# Altium schematic sheet Data Logger.SchDoc
size A; DocumentNumber: 10; SheetNumber: 10; SheetTotal: 16
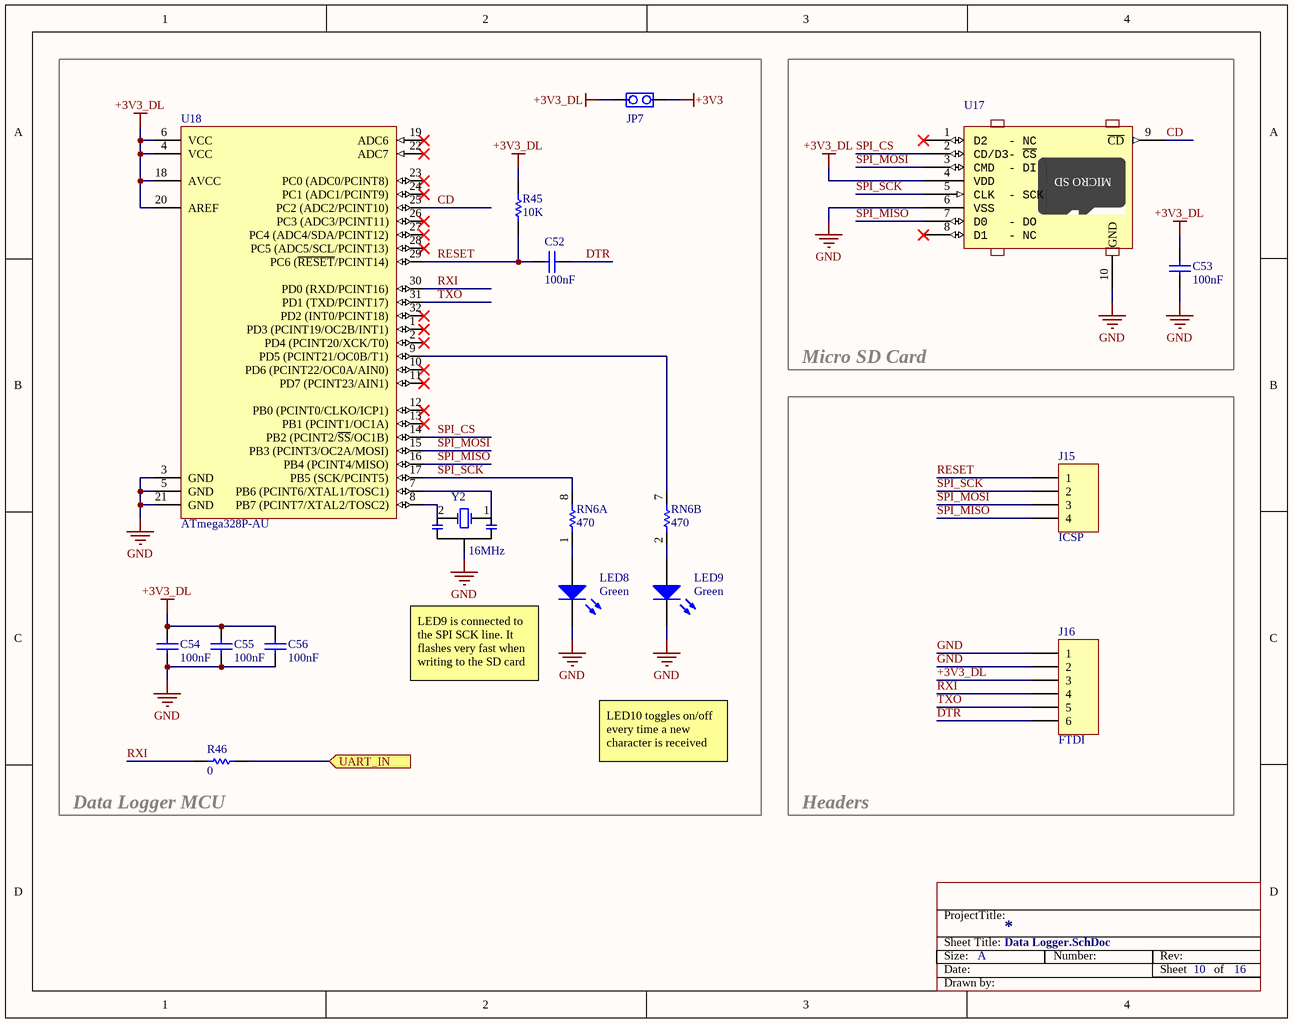
[diagram p0: Data Logger.SchDoc]

## Parts
C52  value 100nF  [CAP_0402[1005M]]  (hidden comment: Cap)
C53  value 100nF  [CAP_0402[1005M]]  (hidden comment: Cap)
C54  value 100nF  [CAP_0402[1005M]]  (hidden comment: Cap)
C55  value 100nF  [CAP_0402[1005M]]  (hidden comment: Cap)
C56  value 100nF  [CAP_0402[1005M]]  (hidden comment: Cap)
J15  ICSP  [1X04]  (no BOM)
J16  FTDI  [HEADER RA 6 2.54]
JP7  Jumper  [HDR_1x02_JMP]  (value not drawn)  (no BOM)
LED8  Color: Green  [LED_0603[1608M]]  (hidden comment: LED)
LED9  Color: Green  [LED_0603[1608M]]  (hidden comment: LED)
R45  value 10K  [RES_0402[1005M]]  (hidden comment: RES)
R46  value 0  [JUMPER_RES_0402]  (hidden comment: RES)
RN6  value 470  [RES ARRAY SMD]  (hidden comment: Res Network 1)  (parts A,B of 4)
U17  MICRO-SD_1  [MICRO-SD_1]  (value not drawn)
U18  ATmega328P-AU  [TQFP32A_M]
Y2  Frequency: 16MHz  [RESONATOR_3213]  (hidden comment: XTAL_3)

## Blocks framed on the sheet
Data Logger MCU: C52 C54-C56 JP7 LED8 LED9 R45 R46 RN6 U18 Y2
Micro SD Card: C53 U17
Headers: J15 J16

## Ports
UART_IN (in)

## Nets
+3V3: JP7.2
+3V3_DL: C53.1 C54.1 C55.1 C56.1 J16.3 JP7.1 R45.2 U17.4(VDD) U18.4(VCC) U18.6(VCC) U18.18(AVCC) U18.20(AREF)
GND: C53.2 C54.2 C55.2 C56.2 J16.1 J16.2 LED8.2(K) LED9.2(K) U17.6(VSS) U17.10(GND) U18.3(GND) U18.5(GND) U18.21(GND) Y2.3(GND)
CD: U17.9(~{CD}) U18.25(PC2_(ADC2/PCINT10))
DTR: C52.2 J16.6
RESET: C52.1 J15.1 R45.1 U18.29(PC6_(~{RESET}/PCINT14))
RXI: J16.4 R46.2 U18.30(PD0_(RXD/PCINT16))
SPI_CS: U17.2(CD/D3-_~{CS}) U18.14(PB2_(PCINT2/~{SS}/OC1B))
SPI_MISO: J15.4 U17.7(D0___-_DO) U18.16(PB4_(PCINT4/MISO))
SPI_MOSI: J15.3 U17.3(CMD__-_DI) U18.15(PB3_(PCINT3/OC2A/MOSI))
SPI_SCK: J15.2 RN6.8 U17.5(CLK__-_SCK) U18.17(PB5_(SCK/PCINT5))
TXO: J16.5 U18.31(PD1_(TXD/PCINT17))
UART_IN: R46.1 ; port UART_IN
NetLED8_1: LED8.1(A) RN6.1
NetLED9_1: LED9.1(A) RN6.2
NetRN6_7: RN6.7 U18.9(PD5_(PCINT21/OC0B/T1))
NetU18_7: U18.7(PB6_(PCINT6/XTAL1/TOSC1)) Y2.1(OSC1)
NetU18_8: U18.8(PB7_(PCINT7/XTAL2/TOSC2)) Y2.2(OSC2)

Not connected (* = marked no-connect by the designer): U17 1(D2___-_NC)* 8(D1___-_NC)*; U18 1(PD3_(PCINT19/OC2B/INT1))* 2(PD4_(PCINT20/XCK/T0))* 10(PD6_(PCINT22/OC0A/AIN0))* 11(PD7_(PCINT23/AIN1))* 12(PB0_(PCINT0/CLKO/ICP1))* 13(PB1_(PCINT1/OC1A))* 19(ADC6)* 22(ADC7)* 23(PC0_(ADC0/PCINT8))* 24(PC1_(ADC1/PCINT9))* 26(PC3_(ADC3/PCINT11))* 27(PC4_(ADC4/SDA/PCINT12))* 28(PC5_(ADC5/SCL/PCINT13))* 32(PD2_(INT0/PCINT18))*

## Notes on the sheet
- (near LED8) LED9 is connected to the SPI SCK line. It flashes very fast when writing to the SD card
- LED10 toggles on/off every time a new character is received
- Sheet Title:
- ProjectTitle:
- Size:
- Date:
- A
- Number:
- Rev:
- Sheet         of
- Drawn by:
- (in symbol MICRO-SD_1) MICRO SD

## Library data of the parts
C52-C56 = Cap: CAP CER 0.1UF 10V 10% X7R 0402; Manufacturer: Yageo; Manufacturer Part Number: CC0402KRX7R6BB104; Supplier 1: Digi-Key; Supplier Part Number 1: 311-1345-1-ND; ComponentLink1Description: Datasheet; ComponentLink1URL: http://www.yageo.com/documents/recent/UPY-GPHC_X7R_6.3V-to-50V-v12.pdf
J15 = Header 4: Header, 4-Pin
J16 = Header 6: Header, 6-Pin; Manufacturer Part Number: 961106-5500-AR-PR; Manufacturer: 3M; Supplier 1: Digi-Key; Supplier Part Number 1: 3M9501CT-ND; ComponentLink1URL: http://multimedia.3m.com/mws/mediawebserver?66666UuZjcFSLXTtNxTEmxfXEVuQEcuZgVs6EVs6E666666--; ComponentLink1Description: Datasheet
LED8 LED9 = LED: LED GREEN CLEAR 0603 SMD; Manufacturer: Lite-On Inc.; Manufacturer Part Number: LTST-C190KGKT; Supplier 1: Digi-Key; Supplier Part Number 1: 160-1435-1-ND; ComponentLink1URL: http://optoelectronics.liteon.com/upload/download/DS22-2000-074/S_110_LTST-C190KGKT.pdf; ComponentLink1Description: Datasheet
R45 = RES: Resistor; Manufacturer: Yageo; Manufacturer Part Number: RC0402FR-0710KL; Supplier 1: Digi-Key; Supplier Part Number 1: 311-10.0KLRCT-ND; ComponentLink1URL: http://www.yageo.com/NewPortal/yageodocoutput?fileName=/pdf/R-Chip/PYu-RC_Group_51_RoHS_L_3.pdf; ComponentLink1Description: Datasheet
R46 = RES: Resistor; Manufacturer Part Number: RC0402JR-070RL; Manufacturer: Yageo; Supplier 1: Digi-Key; Supplier Part Number 1: 311-0.0JRCT-ND; ComponentLink1URL: http://www.yageo.com/NewPortal/yageodocoutput?fileName=/pdf/R-Chip/PYu-RC_Group_51_RoHS_L_3.pdf; ComponentLink1Description: Datasheet
RN6 = Res Network 1: Isolated Resistor Network; Manufacturer: Yageo; Manufacturer Part Number: YC164-JR-07470RL; Supplier 1: Digi-Key; Supplier Part Number 1: YC164J-470CT-ND; ComponentLink1URL: http://www.yageo.com/NewPortal/yageodocoutput?fileName=/pdf/R-Chip/PYu-YC_TC_group_51_RoHS_L_0.pdf; ComponentLink1Description: Datasheet
U17 = MICRO-SD_1: GCT MEM2051-00-195-00-A; Manufacturer: GLOBAL CONNECTOR TECHNOLOGY; Supplier 1: Newark; Supplier Part Number 1: 05W3557; ComponentLink1URL: http://www.farnell.com/datasheets/1792863.pdf; ComponentLink1Description: Datasheet; Manufacturer Part Number: MEM2051-00-195-00-A
U18 = ATmega328P-AU: 8-bit AVR Microcontroller, 32KB Flash, 1KB EEPROM, 2KB SRAM, 32-pin TQFP, Industrial Grade (-40°C to 85°C); Manufacturer: Atmel; PackageVersion: revB, Oct-2001; Supplier 1: Digi-Key; Supplier Part Number 1: ATMEGA328P-AU-ND; Code_JEDEC: MS-026-ABA; ComponentLink1Description: Datasheet; ComponentLink1URL: http://www.atmel.com/dyn/resources/prod_documents/8271.pdf; ComponentLink2Description: ATmega48A/48PA/88A/88PA/168A/168PA/328/328P Summary; ComponentLink2URL: http://www.atmel.com/dyn/resources/prod_documents/8271S.pdf; ComponentLink3Description: Atmel.com Home; ComponentLink3URL: http://www.atmel.com; Manufacturer Part Number: ATMEGA328P-AU
Y2 = XTAL_3: Resonator with built in capacitors; Manufacturer Part Number: CSTCE16M0V53-R0; Manufacturer: Murata Electronics North America; Capacitance: 15pF; Supplier 1: Digi-Key; Supplier Part Number 1: 490-1198-1-ND; ComponentLink1URL: http://www.murata.com/~/media/webrenewal/support/library/catalog/products/timingdevice/ceralock/p16e.ashx; ComponentLink1Description: Datasheet